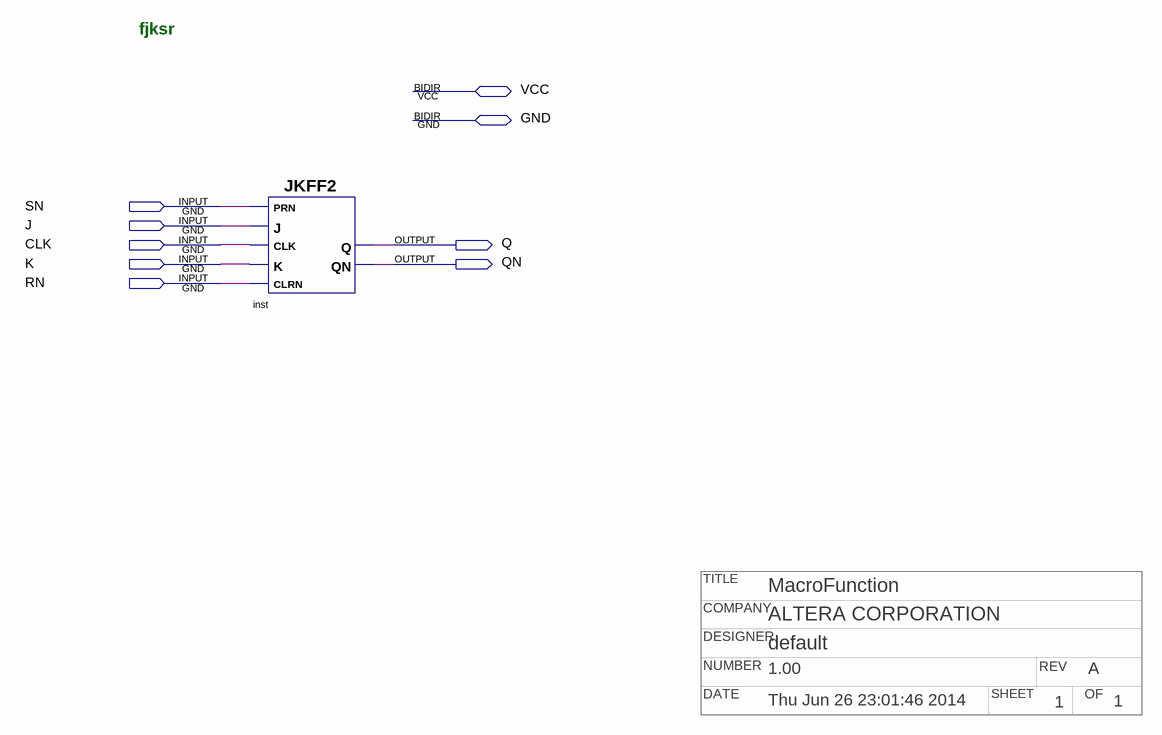
[diagram p0: schematic sheet]
// Quartus schematic npfjksr.bdf as structural Verilog: 1 symbols, 9 pins
// Title block: TITLE: MacroFunction; COMPANY: ALTERA CORPORATION; DESIGNER: default; NUMBER: 1.00; REV: A; DATE: Thu Jun 26 23:01:46 2014; SHEET: 1; OF: 1
module npfjksr (
  input  SN,
  input  J,
  input  CLK,
  input  K,
  input  RN,
  inout  VCC,
  inout  GND,
  output Q,
  output QN
);

  JKFF2 inst (.K(K), .CLRN(RN), .CLK(CLK), .PRN(SN), .J(J), .QN(QN), .Q(Q));

  // Notes on the sheet:
  //   fjksr
endmodule
